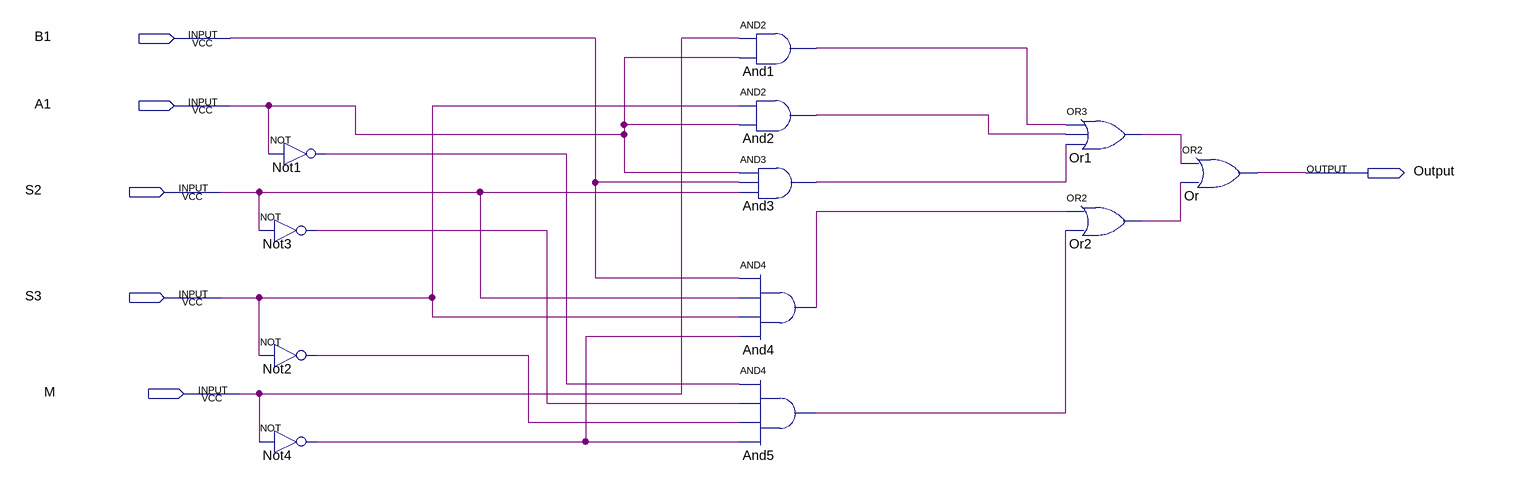
[diagram p0: schematic sheet]
// Quartus schematic AE.bdf as structural Verilog: 12 symbols, 6 pins
module AE (
  input  B1,
  input  A1,
  input  S2,
  input  S3,
  input  M,
  output Output
);

  wire And1_out, And2_out, And3_out, And4_out, And5_out, Not1_out, Not2_out, Not3_out, Not4_out, Or1_out,
       Or2_out;

  not Not1 (Not1_out, A1);
  not Not3 (Not3_out, S2);
  not Not2 (Not2_out, S3);
  not Not4 (Not4_out, M);
  and And1 (And1_out, M, A1);
  and And2 (And2_out, S3, A1);
  and And3 (And3_out, A1, B1, S2);
  and And4 (And4_out, B1, S2, S3, Not4_out);
  and And5 (And5_out, Not1_out, Not3_out, Not2_out, Not4_out);
  or Or1 (Or1_out, And1_out, And2_out, And3_out);
  or Or2 (Or2_out, And4_out, And5_out);
  or Or (Output, Or1_out, Or2_out);
endmodule
